# EAGLE design device (EAGLE 8.2.2)
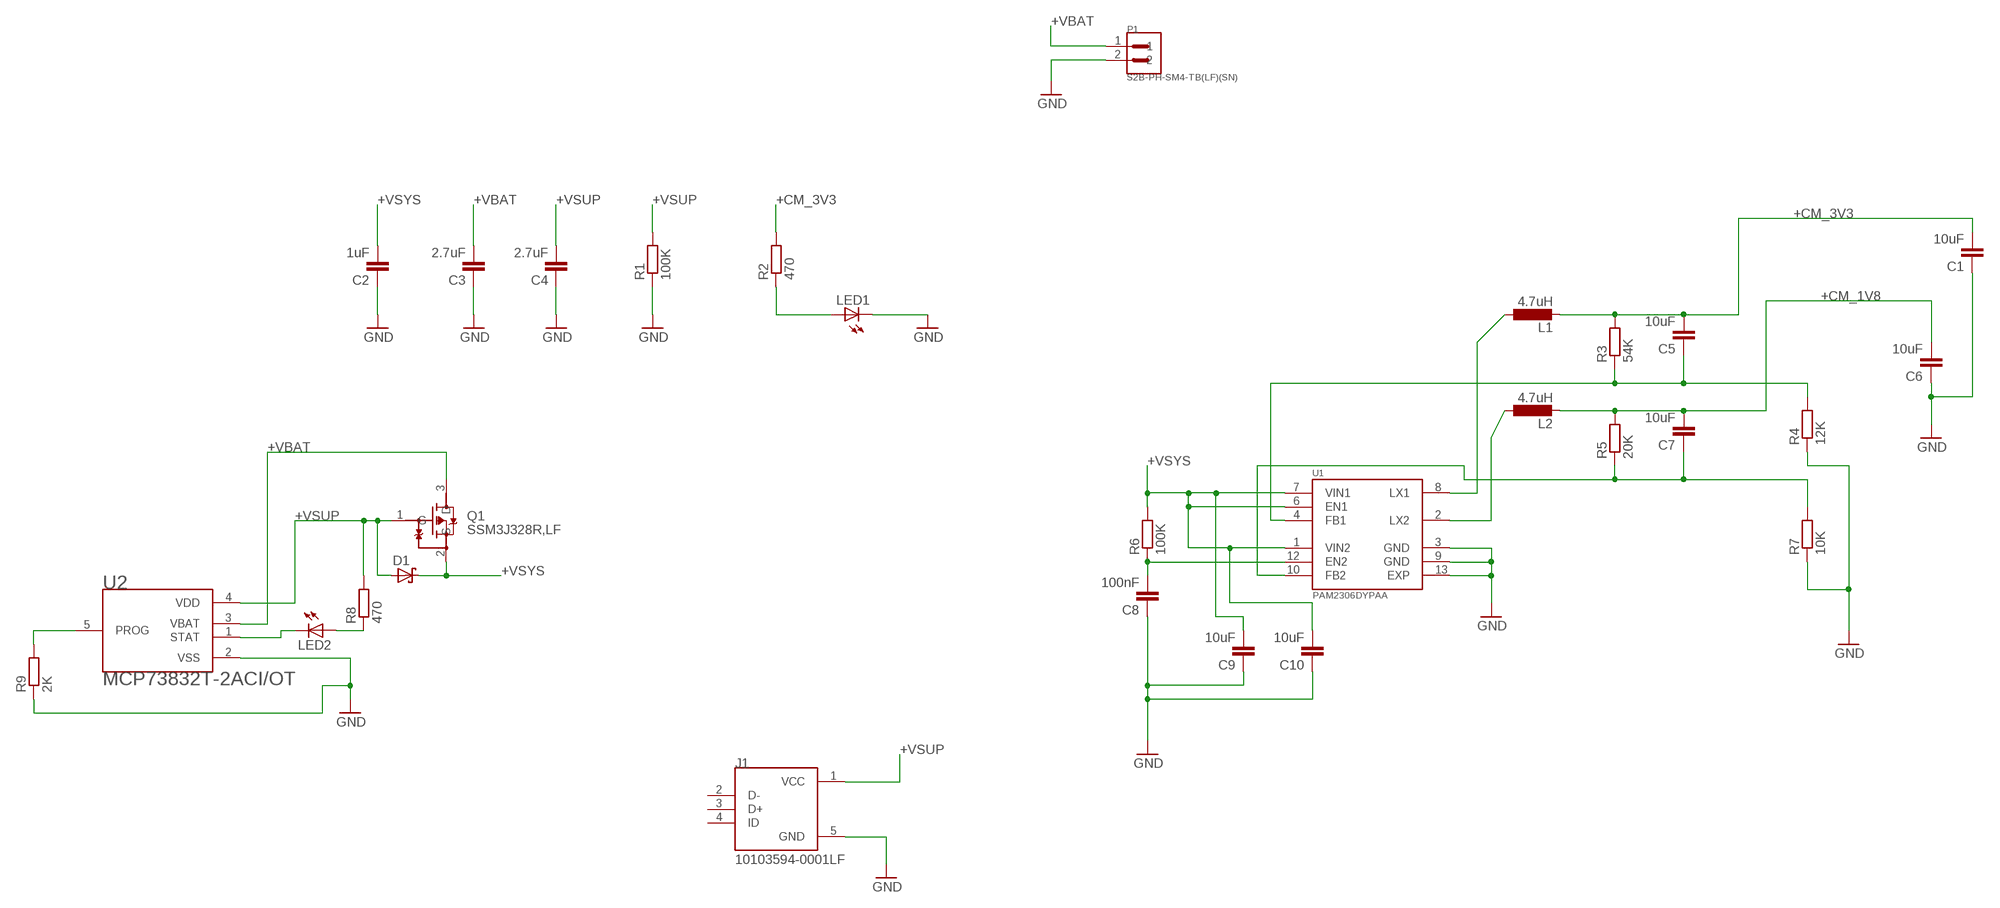
[diagram p0: schematic, sheet 1, part 1 of 2]
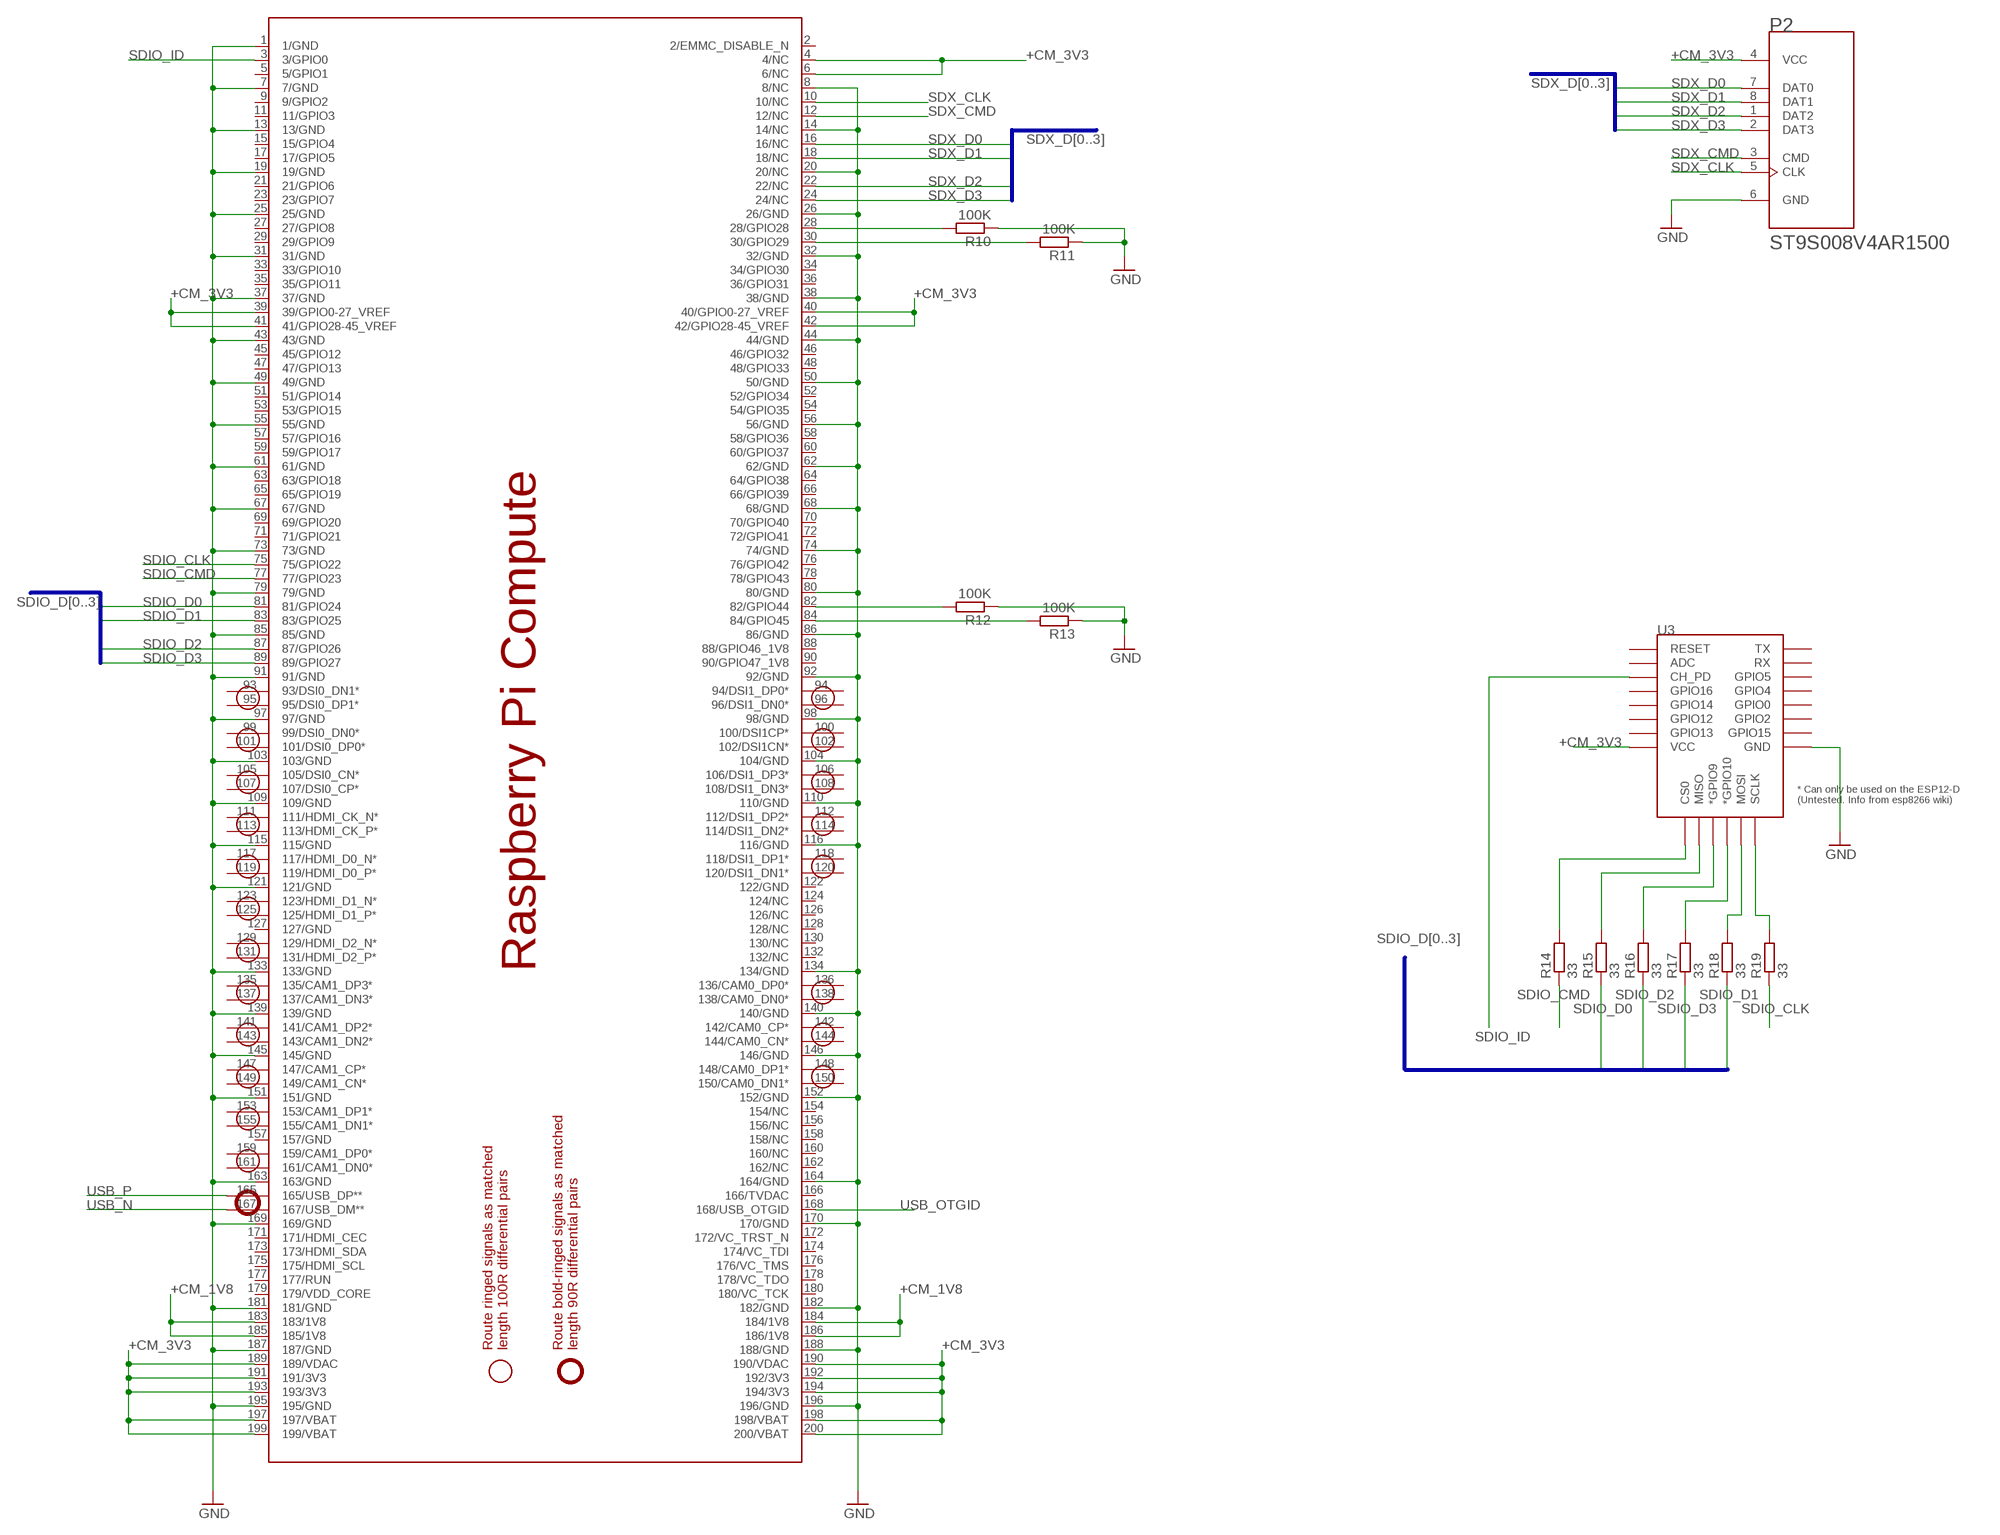
[diagram p1: schematic, sheet 1, part 2 of 2]

## Parts
C1  10uF  C-EUC0603  [C0603]
C2  1uF  C-EUC0603  [C0603]
C3  2.7uF  C-EUC0603  [C0603]
C4  2.7uF  C-EUC0603  [C0603]
C5  10uF  C-EUC0603  [C0603]
C6  10uF  C-EUC0603  [C0603]
C7  10uF  C-EUC0603  [C0603]
C8  100nF  C-EUC0603  [C0603]
C9  10uF  C-EUC0603  [C0603]
C10  10uF  C-EUC0603  [C0603]
D1  SCHOTTKY-DIODESMD  [SMB]
J1  10103594-0001LF  [FCI_10103594-0001LF]
L1  4.7uH  L-EUL1812  [L1812]
L2  4.7uH  L-EUL1812  [L1812]
LED1  LEDCHIP-LED0603  [CHIP-LED0603]
LED2  LEDCHIP-LED0603  [CHIP-LED0603]
P1  S2B-PH-SM4-TB(LF)(SN)  [JST_S2B-PH-SM4-TB(LF)(SN)]
P2  ST9S008V4AR1500  [JAE_ST9S008V4AR1500]
PCB1  RPI_COMPUTE  [RPI_COMPUTE]
Q1  SSM3J328R,LF  [SOT95P240X88-3N]
R1  100K  R-EU_R0603  [R0603]
R2  470  R-EU_R0603  [R0603]
R3  54K  R-EU_R0603  [R0603]
R4  12K  R-EU_R0603  [R0603]
R5  20K  R-EU_R0603  [R0603]
R6  100K  R-EU_R0603  [R0603]
R7  10K  R-EU_R0603  [R0603]
R8  470  R-EU_R0603  [R0603]
R9  2K  R-EU_R0603  [R0603]
R10  100K  R-EU_R0603  [R0603]
R11  100K  R-EU_R0603  [R0603]
R12  100K  R-EU_R0603  [R0603]
R13  100K  R-EU_R0603  [R0603]
R14  33  R-EU_R0603  [R0603]
R15  33  R-EU_R0603  [R0603]
R16  33  R-EU_R0603  [R0603]
R17  33  R-EU_R0603  [R0603]
R18  33  R-EU_R0603  [R0603]
R19  33  R-EU_R0603  [R0603]
U1  PAM2306DYPAA  [SON45P300X300X80-13N]
U2  MCP73832T-2ACI/OT  [SOT95P270X145-5N]
U3  ESP12ESMD  [ESP12E-SMD]

## Nets
+CM_1V8 [power]: C6.2 C7.2 L2.2 PCB1.183(183/1V8) PCB1.184(184/1V8) PCB1.185(185/1V8) PCB1.186(186/1V8) R5.2
+CM_3V3 [power]: C1.2 C5.2 L1.2 P2.4(VCC) PCB1.4(4/NC) PCB1.6(6/NC) PCB1.39(39/GPIO0-27_VREF) PCB1.40(40/GPIO0-27_VREF) PCB1.41(41/GPIO28-45_VREF) PCB1.42(42/GPIO28-45_VREF) PCB1.189(189/VDAC) PCB1.190(190/VDAC) PCB1.191(191/3V3) PCB1.192(192/3V3) PCB1.193(193/3V3) PCB1.194(194/3V3) PCB1.197(197/VBAT) PCB1.198(198/VBAT) PCB1.199(199/VBAT) PCB1.200(200/VBAT) R2.2 R3.2 U3.VCC
+VBAT [power]: C3.2 P1.1 Q1.3(D) U2.3(VBAT)
+VSUP [power]: C4.2 D1.A J1.1(VCC) Q1.1(G) R1.2 R8.2 U2.4(VDD)
+VSYS [power]: C2.2 C9.2 C10.2 D1.C Q1.2(S) R6.2 U1.1(VIN2) U1.6(EN1) U1.7(VIN1)
GND [power]: C1.1 C2.1 C3.1 C4.1 C6.1 C8.1 C9.1 C10.1 J1.5(GND) LED1.C P1.2 P2.6(GND) PCB1.1(1/GND) PCB1.7(7/GND) PCB1.8(8/NC) PCB1.13(13/GND) PCB1.14(14/NC) PCB1.19(19/GND) PCB1.20(20/NC) PCB1.25(25/GND) PCB1.26(26/GND) PCB1.31(31/GND) PCB1.32(32/GND) PCB1.37(37/GND) PCB1.38(38/GND) PCB1.43(43/GND) PCB1.44(44/GND) PCB1.49(49/GND) PCB1.50(50/GND) PCB1.55(55/GND) PCB1.56(56/GND) PCB1.61(61/GND) PCB1.62(62/GND) PCB1.67(67/GND) PCB1.68(68/GND) PCB1.73(73/GND) PCB1.74(74/GND) PCB1.79(79/GND) PCB1.80(80/GND) PCB1.85(85/GND) PCB1.86(86/GND) PCB1.91(91/GND) PCB1.92(92/GND) PCB1.97(97/GND) PCB1.98(98/GND) PCB1.103(103/GND) PCB1.104(104/GND) PCB1.109(109/GND) PCB1.110(110/GND) PCB1.115(115/GND) PCB1.116(116/GND) PCB1.121(121/GND) PCB1.133(133/GND) PCB1.134(134/GND) PCB1.139(139/GND) PCB1.140(140/GND) PCB1.145(145/GND) PCB1.146(146/GND) PCB1.151(151/GND) PCB1.152(152/GND) PCB1.163(163/GND) PCB1.164(164/GND) PCB1.169(169/GND) PCB1.170(170/GND) PCB1.181(181/GND) PCB1.182(182/GND) PCB1.187(187/GND) PCB1.188(188/GND) PCB1.195(195/GND) PCB1.196(196/GND) R1.1 R4.1 R7.1 R9.1 R10.1 R11.1 R12.1 R13.1 U1.3(GND) U1.9(GND) U1.13(EXP) U2.2(VSS) U3.GND
N$1: PCB1.84(84/GPIO45) R13.2
N$2: C8.2 R6.1 U1.12(EN2)
N$3: LED2.C U2.1(STAT)
N$4 [power]: R9.2 U2.5(PROG)
N$5: LED2.A R8.1
N$6: PCB1.28(28/GPIO28) R10.2
N$7: PCB1.30(30/GPIO29) R11.2
N$8: C5.1 R3.1 R4.2 U1.4(FB1)
N$9: PCB1.82(82/GPIO44) R12.2
N$10: C7.1 R5.1 R7.2 U1.10(FB2)
N$11 [power]: L1.1 U1.8(LX1)
N$12 [power]: L2.1 U1.2(LX2)
N$14: LED1.A R2.1
N$15: R19.2 U3.SCLK
N$16: R18.2 U3.MOSI
N$17: R17.2 U3.GPIO10(*GPIO10)
N$18: R16.2 U3.GPIO9(*GPIO9)
N$19: R15.2 U3.MISO
N$20: R14.2 U3.CS0
SDIO_CLK: PCB1.75(75/GPIO22) R19.1
SDIO_CMD: PCB1.77(77/GPIO23) R14.1
SDIO_D0: PCB1.81(81/GPIO24) R15.1
SDIO_D1: PCB1.83(83/GPIO25) R18.1
SDIO_D2: PCB1.87(87/GPIO26) R16.1
SDIO_D3: PCB1.89(89/GPIO27) R17.1
SDIO_ID: PCB1.3(3/GPIO0) U3.CH_PD
SDX_CLK: P2.5(CLK) PCB1.10(10/NC)
SDX_CMD: P2.3(CMD) PCB1.12(12/NC)
SDX_D0: P2.7(DAT0) PCB1.16(16/NC)
SDX_D1: P2.8(DAT1) PCB1.18(18/NC)
SDX_D2: P2.1(DAT2) PCB1.22(22/NC)
SDX_D3: P2.2(DAT3) PCB1.24(24/NC)
USB_N: PCB1.167(167/USB_DM**)
USB_OTGID: PCB1.168(168/USB_OTGID)
USB_P: PCB1.165(165/USB_DP**)
Unconnected: J1.2(D-) J1.3(D+) J1.4(ID) PCB1.2(2/EMMC_DISABLE_N) PCB1.5(5/GPIO1) PCB1.9(9/GPIO2) PCB1.11(11/GPIO3) PCB1.15(15/GPIO4) PCB1.17(17/GPIO5) PCB1.21(21/GPIO6) PCB1.23(23/GPIO7) PCB1.27(27/GPIO8) PCB1.29(29/GPIO9) PCB1.33(33/GPIO10) PCB1.34(34/GPIO30) PCB1.35(35/GPIO11) PCB1.36(36/GPIO31) PCB1.45(45/GPIO12) PCB1.46(46/GPIO32) PCB1.47(47/GPIO13) PCB1.48(48/GPIO33) PCB1.51(51/GPIO14) PCB1.52(52/GPIO34) PCB1.53(53/GPIO15) PCB1.54(54/GPIO35) PCB1.57(57/GPIO16) PCB1.58(58/GPIO36) PCB1.59(59/GPIO17) PCB1.60(60/GPIO37) PCB1.63(63/GPIO18) PCB1.64(64/GPIO38) PCB1.65(65/GPIO19) PCB1.66(66/GPIO39) PCB1.69(69/GPIO20) PCB1.70(70/GPIO40) PCB1.71(71/GPIO21) PCB1.72(72/GPIO41) PCB1.76(76/GPIO42) PCB1.78(78/GPIO43) PCB1.88(88/GPIO46_1V8) PCB1.90(90/GPIO47_1V8) PCB1.93(93/DSI0_DN1*) PCB1.94(94/DSI1_DP0*) PCB1.95(95/DSI0_DP1*) PCB1.96(96/DSI1_DN0*) PCB1.99(99/DSI0_DN0*) PCB1.100(100/DSI1CP*) PCB1.101(101/DSI0_DP0*) PCB1.102(102/DSI1CN*) PCB1.105(105/DSI0_CN*) PCB1.106(106/DSI1_DP3*) PCB1.107(107/DSI0_CP*) PCB1.108(108/DSI1_DN3*) PCB1.111(111/HDMI_CK_N*) PCB1.112(112/DSI1_DP2*) PCB1.113(113/HDMI_CK_P*) PCB1.114(114/DSI1_DN2*) PCB1.117(117/HDMI_D0_N*) PCB1.118(118/DSI1_DP1*) PCB1.119(119/HDMI_D0_P*) PCB1.120(120/DSI1_DN1*) PCB1.122(122/GND) PCB1.123(123/HDMI_D1_N*) PCB1.124(124/NC) PCB1.125(125/HDMI_D1_P*) PCB1.126(126/NC) PCB1.127(127/GND) PCB1.128(128/NC) PCB1.129(129/HDMI_D2_N*) PCB1.130(130/NC) PCB1.131(131/HDMI_D2_P*) PCB1.132(132/NC) PCB1.135(135/CAM1_DP3*) PCB1.136(136/CAM0_DP0*) PCB1.137(137/CAM1_DN3*) PCB1.138(138/CAM0_DN0*) PCB1.141(141/CAM1_DP2*) PCB1.142(142/CAM0_CP*) PCB1.143(143/CAM1_DN2*) PCB1.144(144/CAM0_CN*) PCB1.147(147/CAM1_CP*) PCB1.148(148/CAM0_DP1*) PCB1.149(149/CAM1_CN*) PCB1.150(150/CAM0_DN1*) PCB1.153(153/CAM1_DP1*) PCB1.154(154/NC) PCB1.155(155/CAM1_DN1*) PCB1.156(156/NC) PCB1.157(157/GND) PCB1.158(158/NC) PCB1.159(159/CAM1_DP0*) PCB1.160(160/NC) PCB1.161(161/CAM1_DN0*) PCB1.162(162/NC) PCB1.166(166/TVDAC) PCB1.171(171/HDMI_CEC) PCB1.172(172/VC_TRST_N) PCB1.173(173/HDMI_SDA) PCB1.174(174/VC_TDI) PCB1.175(175/HDMI_SCL) PCB1.176(176/VC_TMS) PCB1.177(177/RUN) PCB1.178(178/VC_TDO) PCB1.179(179/VDD_CORE) PCB1.180(180/VC_TCK) U3.ADC U3.GPIO0 U3.GPIO2 U3.GPIO4 U3.GPIO5 U3.GPIO12 U3.GPIO13 U3.GPIO14 U3.GPIO15 U3.GPIO16 U3.RESET U3.RXD0(RX) U3.TXD0(TX)

## Buses
SDX_D[0..3]
SDIO_D[0..3]

## Library data of the parts
C1-C10 = resistor:C-EU: CAPACITOR, European symbol
D1 = diode:SCHOTTKY-DIODE: Schottky Diode
J1 = Common-Parts-Library-Eagle:10103594-0001LF: Conn Micro USB Type B RCP 5 POS 0.65mm Solder RA SMD 5 Terminal 1 Port T/R; MANUFACTURER: Framatome
L1 L2 = resistor:L-EU: INDUCTOR, European symbol
LED1 LED2 = led:LED: LED OSRAM: - CHIPLED LG R971, LG N971, LY N971, LG Q971, LY Q971, LO R971, LY R971 LH N974, LH R974 LS Q976, LO Q976, LY Q976 LO Q996 - Hyper CHIPLED LW Q18S LB Q993, LB Q99A, LB R99A - SideLED LS A670, LO A670, LY A670, LG A670, LP A670 LB A673, LV A673, LT A673, LW A673 LH A674 LY A675 LS A676, LA A676, LO A676, LY A676, LW A676 LS A679, LY A679, LG A679 - Hyper Micro SIDELED® LS Y876, LA Y876, LO Y876, LY Y876 LT Y87S - SmartLED LW L88C, LW L88S LB L89C, LB L89S, LG L890 LS L89K, LO L89K, LY L89K LS L896, LA L896, LO L896, LY L896 - TOPLED LS T670, LO T670, LY T670, LG T670, LP T670 LSG T670, LSP T670, LSY T670, LOP T670, LYG T670 LG T671, LOG T671, LSG T671 LB T673, LV T673, LT T673, LW T673 LH T674 LS T676, LA T676, LO T676, LY T676, LB T676, LH T676, LSB T676, LW T676 LB T67C, LV T67C, LT T67C, LS T67K, LO T67K, LY T67K, LW E67C LS E67B, LA E67B, LO E67B, LY E67B, LB E67C, LV E67C, LT E67C LW T67C LS T679, LY T679, LG T679 LS T770, LO T770, LY T770, LG T770, LP T770 LB T773, LV T773, LT T773, LW T773 LH T774 LS E675, LA E675, LY E675, LS T675 LS T776, LA T776, LO T776, LY T776, LB T776 LHGB T686 LT T68C, LB T68C - Hyper Mini TOPLED® LB M676 - Mini TOPLED Santana® LG M470 LS M47K, LO M47K, LY M47K Source: http://www.osram.convergy.de LUXEON: - LUMILED® LXK2-PW12-R00, LXK2-PW12-S00, LXK2-PW14-U00, LXK2-PW14-V00 LXK2-PM12-R00, LXK2-PM12-S00, LXK2-PM14-U00 LXK2-PE12-Q00, LXK2-PE12-R00, LXK2-PE12-S00, LXK2-PE14-T00, LXK2-PE14-U00 LXK2-PB12-K00, LXK2-PB12-L00, LXK2-PB12-M00, LXK2-PB14-N00, LXK2-PB14-P00, LXK2-PB14-Q00 LXK2-PR12-L00, LXK2-PR12-M00, LXK2-PR14-Q00, LXK2-PR14-R00 LXK2-PD12-Q00, LXK2-PD12-R00, LXK2-PD12-S00 LXK2-PH12-R00, LXK2-PH12-S00 LXK2-PL12-P00, LXK2-PL12-Q00, LXK2-PL12-R00 Source: www.luxeon.com KINGBRIGHT: KA-3528ASYC Source: www.kingbright.com
P1 = Common-Parts-Library-Eagle:S2B-PH-SM4-TB(LF)(SN): CONN HEADER PH SIDE 2POS 2MM SMD; MANUFACTURER: JST
P2 = Common-Parts-Library-Eagle:ST9S008V4AR1500: Conn; Data; microSD; 8+2Cnts; SMD/SMT; SF9Series; RtAngle; 0.5A; 10V; forMicroSDCard; MANUFACTURER: JAE
PCB1 = e14_Rpi_Compute_RevC:RPI_COMPUTE: Device for a Raspberry PI Compute module. Note that the package is for a DDR2 connector of 'standard' orientation. Example: TE Connectivity P/N: 1565917-4, Newark P/N: 08P0616, Farnell P/N: 2112525 More information is available at http://www.element14.com/community/community/raspberry-pi/raspberry-pi-compute-module
Q1 = Common-Parts-Library-Eagle:SSM3J328R,LF: Trans MOSFET P-CH 20V 6A 3-Pin SOT-23F; MANUFACTURER: Toshiba
R1-R19 = resistor:R-EU_: RESISTOR, European symbol
U1 = PAM2306DYPAA:PAM2306DYPAA: PAM2306 Series 5.5V 1A Dual High Efficiency PWM Step Down DC-DC Converter-WDFN12; AVAILABILITY: Good; DESCRIPTION: PAM2306 Series 5.5V 1A Dual High Efficiency PWM Step Down DC-DC Converter-WDFN12; MF: Diodes Inc.; MP: PAM2306DYPAA; PACKAGE: WFDFN-12 Diodes Inc.; PRICE: 0.41 USD
U2 = Common-Parts-Library-Eagle:MCP73832T-2ACI/OT: MCP73832 Series Single-Cell Li-Ion/Li-Polymer Battery Charge Controller SOT-23-5; MANUFACTURER: Microchip
U3 = esp8266modules:ESP12E: ESP12E Module

## Net classes
0 default: width 0.203 mm
1 power: width 0.305 mm, drill 0.406 mm

## Board
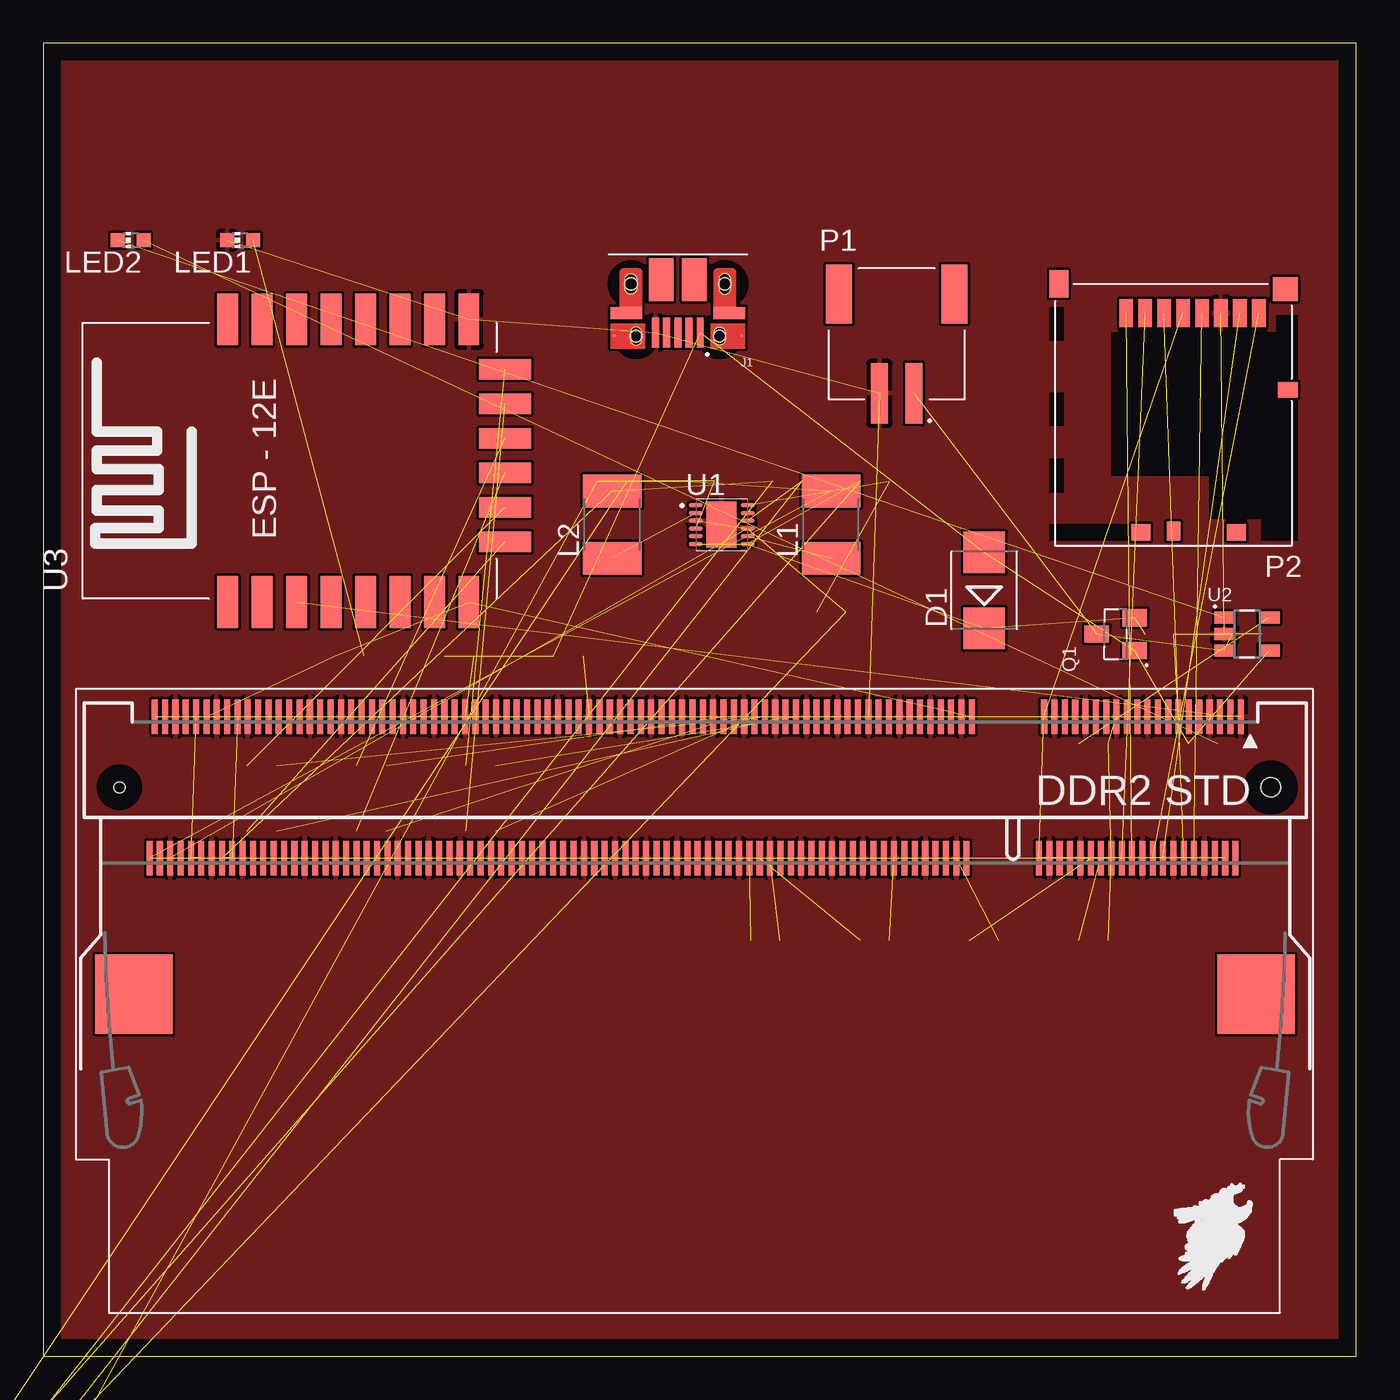
[diagram p2: board, top side]
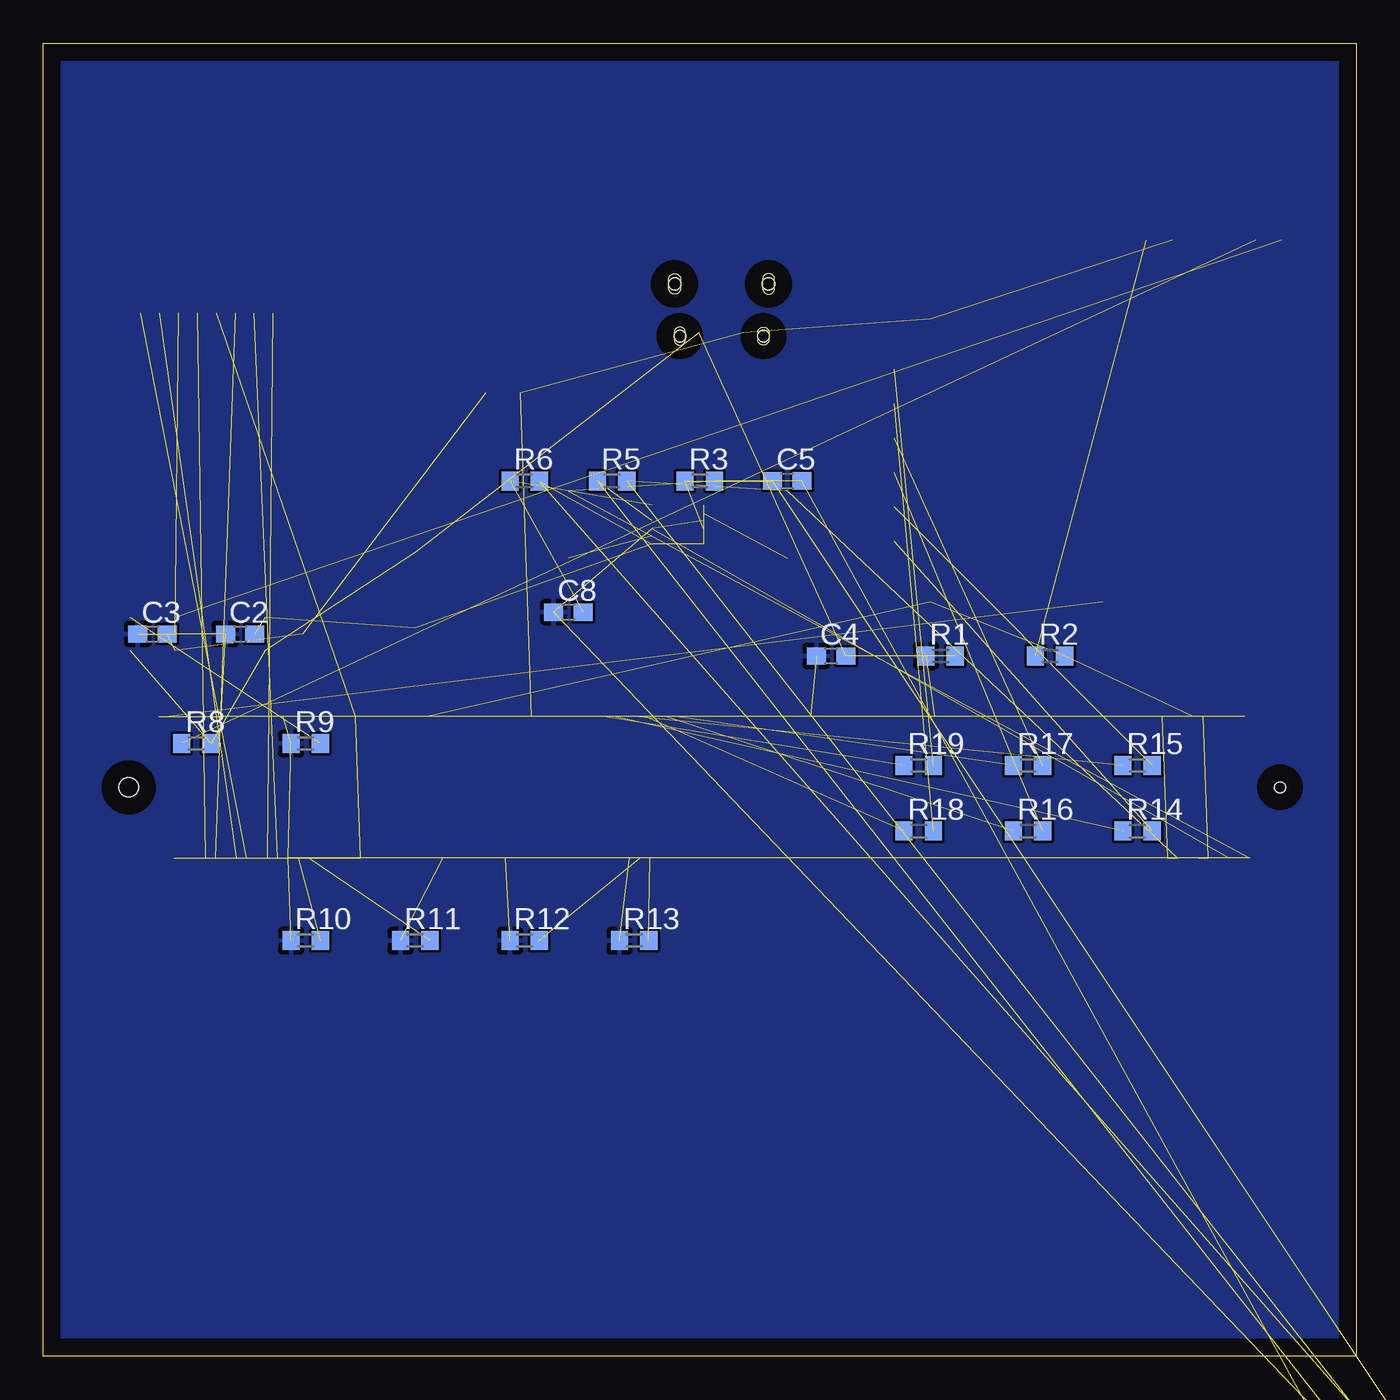
[diagram p3: board, bottom side, seen from below]

Size 76.2 x 76.2 mm. Coordinates in mm from the lower left corner, seen from the top.
Outline: 0,0 76.2,0 76.2,76.2 0,76.2 0,0
Copper layers (1*16): Top 0.035mm / dielectric 1.5mm / Bottom 0.035mm
Design rules "default": minimum track width 6mil, minimum drill 0.35mm, track to track 6mil, track to pad 6mil, pad to pad 6mil, via to via 6mil, smd to smd 6mil, copper to edge 40mil, drill to drill 6mil, minimum pad ring 10mil, minimum via ring 8mil, stop-mask expansion 4mil, vias tented up to drill 0mil, thermal gap 10mil

### Footprints (pad centres in the part's own frame; a part is rotated, then mirrored left to right if it is on the bottom)
C0603 = smd 1.1 x 1: 1 -0.85,0; 2 0.85,0
SMB = smd 2.4 x 2.4: A 2.2,0; C -2.2,0
FCI_10103594-0001LF = smd 0.4 x 1.75: 1 -1.3,2.825; 2 -0.65,2.825; 3 0,2.825; 4 0.65,2.825; 5 1.3,2.825 | smd 0.1 x 0.1: P1 -3.7,3; P2 3.7,3 | smd 1.825 x 0.7: P3 -2.987,1.7; P4 2.987,1.7 | smd 1.425 x 2.5: P5 -0.963,-0.25; P6 0.963,-0.25 | hole 0.7: -2.725,0; 2.725,0 | hole 0.65: -2.425,3.03; 2.425,3.03
L1812 = smd 1.9 x 3.4: 1 -1.95,0; 2 1.95,0
CHIP-LED0603 = smd 0.8 x 0.8: A 0,-0.75; C 0,0.75
JST_S2B-PH-SM4-TB(LF)(SN) = smd 1 x 3.5: 1 1,0; 2 -1,0 | smd 1.5 x 3.4: P1 3.35,5.75; P2 -3.35,5.75
JAE_ST9S008V4AR1500 = smd 0.8 x 1.6: 1 3.2,1.7; 2 2.1,1.7; 3 1,1.7; 4 -0.1,1.7; 5 -1.2,1.7; 6 -2.3,1.7; 7 -3.4,1.7; 8 -4.5,1.7 | smd 1.1 x 0.95: PAD1 -3.2,14.425; PAD3 2.35,14.425 | smd 0.8 x 1.1: PAD2 0.45,14.35 | smd 1.15 x 0.9: PAD4 -6.175,6.15 | smd 1.45 x 1.4: PAD5 -6.025,0.3 | smd 1.1 x 1.6: PAD6 7.1,0
RPI_COMPUTE = smd 0.35 x 2: 1 -31.38,-4.1; 2 -31.08,4.1; 3 -30.78,-4.1; 4 -30.48,4.1; 5 -30.18,-4.1; 6 -29.88,4.1; 7 -29.58,-4.1; 8 -29.28,4.1; 9 -28.98,-4.1; 10 -28.68,4.1; 11 -28.38,-4.1; 12 -28.08,4.1; 13 -27.78,-4.1; 14 -27.48,4.1; 15 -27.18,-4.1; 16 -26.88,4.1; 17 -26.58,-4.1; 18 -26.28,4.1; 19 -25.98,-4.1; 20 -25.68,4.1; 21 -25.38,-4.1; 22 -25.08,4.1; 23 -24.78,-4.1; 24 -24.48,4.1; 25 -24.18,-4.1; 26 -23.88,4.1; 27 -23.58,-4.1; 28 -23.28,4.1; 29 -22.98,-4.1; 30 -22.68,4.1; 31 -22.38,-4.1; 32 -22.08,4.1; 33 -21.78,-4.1; 34 -21.48,4.1; 35 -21.18,-4.1; 36 -20.88,4.1; 37 -20.58,-4.1; 38 -20.28,4.1; 39 -19.98,-4.1; 40 -19.68,4.1; 41 -15.78,-4.1; 42 -15.48,4.1; 43 -15.18,-4.1; 44 -14.88,4.1; 45 -14.58,-4.1; 46 -14.28,4.1; 47 -13.98,-4.1; 48 -13.68,4.1; 49 -13.38,-4.1; 50 -13.08,4.1; 51 -12.78,-4.1; 52 -12.48,4.1; 53 -12.18,-4.1; 54 -11.88,4.1; 55 -11.58,-4.1; 56 -11.28,4.1; 57 -10.98,-4.1; 58 -10.68,4.1; 59 -10.38,-4.1; 60 -10.08,4.1; 61 -9.78,-4.1; 62 -9.48,4.1; 63 -9.18,-4.1; 64 -8.88,4.1; 65 -8.58,-4.1; 66 -8.28,4.1; 67 -7.98,-4.1; 68 -7.68,4.1; 69 -7.38,-4.1; 70 -7.08,4.1; 71 -6.78,-4.1; 72 -6.48,4.1; 73 -6.18,-4.1; 74 -5.88,4.1; 75 -5.58,-4.1; 76 -5.28,4.1; 77 -4.98,-4.1; 78 -4.68,4.1; 79 -4.38,-4.1; 80 -4.08,4.1; 81 -3.78,-4.1; 82 -3.48,4.1; 83 -3.18,-4.1; 84 -2.88,4.1; 85 -2.58,-4.1; 86 -2.28,4.1; 87 -1.98,-4.1; 88 -1.68,4.1; 89 -1.38,-4.1; 90 -1.08,4.1; 91 -0.78,-4.1; 92 -0.48,4.1; 93 -0.18,-4.1; 94 0.12,4.1; 95 0.42,-4.1; 96 0.72,4.1; 97 1.02,-4.1; 98 1.32,4.1; 99 1.62,-4.1; 100 1.92,4.1; 101 2.22,-4.1; 102 2.52,4.1; 103 2.82,-4.1; 104 3.12,4.1; 105 3.42,-4.1; 106 3.72,4.1; 107 4.02,-4.1; 108 4.32,4.1; 109 4.62,-4.1; 110 4.92,4.1; 111 5.22,-4.1; 112 5.52,4.1; 113 5.82,-4.1; 114 6.12,4.1; 115 6.42,-4.1; 116 6.72,4.1; 117 7.02,-4.1; 118 7.32,4.1; 119 7.62,-4.1; 120 7.92,4.1; 121 8.22,-4.1; 122 8.52,4.1; 123 8.82,-4.1; 124 9.12,4.1; 125 9.42,-4.1; 126 9.72,4.1; 127 10.02,-4.1; 128 10.32,4.1; 129 10.62,-4.1; 130 10.92,4.1; 131 11.22,-4.1; 132 11.52,4.1; 133 11.82,-4.1; 134 12.12,4.1; 135 12.42,-4.1; 136 12.72,4.1; 137 13.02,-4.1; 138 13.32,4.1; 139 13.62,-4.1; 140 13.92,4.1; 141 14.22,-4.1; 142 14.52,4.1; 143 14.82,-4.1; 144 15.12,4.1; 145 15.42,-4.1; 146 15.72,4.1; 147 16.02,-4.1; 148 16.32,4.1; 149 16.62,-4.1; 150 16.92,4.1; 151 17.22,-4.1; 152 17.52,4.1; 153 17.82,-4.1; 154 18.12,4.1; 155 18.42,-4.1; 156 18.72,4.1; 157 19.02,-4.1; 158 19.32,4.1; 159 19.62,-4.1; 160 19.92,4.1; 161 20.22,-4.1; 162 20.52,4.1; 163 20.82,-4.1; 164 21.12,4.1; 165 21.42,-4.1; 166 21.72,4.1; 167 22.02,-4.1; 168 22.32,4.1; 169 22.62,-4.1; 170 22.92,4.1; 171 23.22,-4.1; 172 23.52,4.1; 173 23.82,-4.1; 174 24.12,4.1; 175 24.42,-4.1; 176 24.72,4.1; 177 25.02,-4.1; 178 25.32,4.1; 179 25.62,-4.1; 180 25.92,4.1; 181 26.22,-4.1; 182 26.52,4.1; 183 26.82,-4.1; 184 27.12,4.1; 185 27.42,-4.1; 186 27.72,4.1; 187 28.02,-4.1; 188 28.32,4.1; 189 28.62,-4.1; 190 28.92,4.1; 191 29.22,-4.1; 192 29.52,4.1; 193 29.82,-4.1; 194 30.12,4.1; 195 30.42,-4.1; 196 30.72,4.1; 197 31.02,-4.1; 198 31.32,4.1; 199 31.62,-4.1; 200 31.92,4.1 | smd 4.5 x 4.6: M1 -32.28,12; M2 32.82,12 | hole 1.1: -33.13,0 | hole 0.6: 33.67,0
SOT95P240X88-3N = smd 1 x 1.4: 1 -0.95,-1.1; 2 0.95,-1.1; 3 0,1.1
R0603 = smd 1 x 1.1: 1 -0.85,0; 2 0.85,0
SON45P300X300X80-13N = smd 0.8 x 0.25: 1 -1.5,1.125; 2 -1.5,0.675; 3 -1.5,0.225; 4 -1.5,-0.225; 5 -1.5,-0.675; 6 -1.5,-1.125; 7 1.5,-1.125; 8 1.5,-0.675; 9 1.5,-0.225; 10 1.5,0.225; 11 1.5,0.675; 12 1.5,1.125 | smd 1.75 x 2.65: 13 0,0
SOT95P270X145-5N = smd 1.2 x 0.7: 1 -1.3,0.95; 2 -1.3,0; 3 -1.3,-0.95; 4 1.3,-0.95; 5 1.3,0.95
ESP12E-SMD = smd 3 x 1.2: ADC -8.3,3.8; CH_PD -8.3,1.8; GND 8.1,-8.2; GPIO0 8.1,-2.2; GPIO2 8.1,-4.2; GPIO4 8.1,-0.2; GPIO5 8.1,1.8; GPIO12 -8.3,-4.2; GPIO13 -8.3,-6.2; GPIO14 -8.3,-2.2; GPIO15 8.1,-6.2; GPIO16 -8.3,-0.2; RESET -8.3,5.8; RXD0 8.1,3.8; TXD0 8.1,5.8; VCC -8.3,-8.2 | smd 1.2 x 3: CS0 -4.8,-10.3; GPIO9 -0.8,-10.3; GPIO10 1.2,-10.3; MISO -2.8,-10.3; MOSI 3.2,-10.3; SCLK 5.2,-10.3

### Placement (x,y rotation side)
C1  -26.67,-58.42 0 bottom  (outside the outline)
C2  64.77,41.91 0 bottom
C3  69.85,41.91 0 bottom
C4  30.48,40.64 0 bottom
C5  33.02,50.8 0 bottom
C6  -26.67,-53.34 0 bottom  (outside the outline)
C7  -26.67,-38.1 0 bottom  (outside the outline)
C8  45.72,43.18 0 bottom
C9  -7.62,-12.7 0 bottom  (outside the outline)
C10  -8.89,-17.78 0 bottom  (outside the outline)
D1  54.61,44.45 90 top
J1  36.83,62.23 180 top
L1  45.72,48.26 90 top
L2  33.02,48.26 90 top
LED1  11.43,64.77 90 top
LED2  5.08,64.77 90 top
P1  49.53,55.88 0 top
P2  66.04,62.23 180 top
PCB1  38.1,33.02 180 top
Q1  62.23,41.91 90 top
R1  24.13,40.64 0 bottom
R2  17.78,40.64 0 bottom
R3  38.1,50.8 0 bottom
R4  -27.94,-43.18 0 bottom  (outside the outline)
R5  43.18,50.8 0 bottom
R6  48.26,50.8 0 bottom
R7  -27.94,-48.26 0 bottom  (outside the outline)
R8  67.31,35.56 0 bottom
R9  60.96,35.56 0 bottom
R10  60.96,24.13 0 bottom
R11  54.61,24.13 0 bottom
R12  48.26,24.13 0 bottom
R13  41.91,24.13 0 bottom
R14  12.7,30.48 0 bottom
R15  12.7,34.29 0 bottom
R16  19.05,30.48 0 bottom
R17  19.05,34.29 0 bottom
R18  25.4,30.48 0 bottom
R19  25.4,34.29 0 bottom
U1  39.37,48.26 0 top
U2  69.85,41.91 0 top
U3  16.51,52.07 90 top

### Tracks (layer width: path | path; a pad name or v marks a point on that pad's centre or on a via)
+CM_1V8  (7 unrouted)
+CM_3V3  (22 unrouted)
+VBAT  (3 unrouted)
+VSUP  (6 unrouted)
+VSYS  (8 unrouted)
GND  (82 unrouted)
  pour Top: 0,76.2 0,0 76.2,0 76.2,76.2
  pour Bottom: 0,76.2 0,0 76.2,0 76.2,76.2
N$1  (1 unrouted)
N$2  (2 unrouted)
N$3  (1 unrouted)
N$4  (1 unrouted)
N$5  (1 unrouted)
N$6  (1 unrouted)
N$7  (1 unrouted)
N$8  (3 unrouted)
N$9  (1 unrouted)
N$10  (3 unrouted)
N$11  (1 unrouted)
N$12  (1 unrouted)
N$14  (1 unrouted)
N$15  (1 unrouted)
N$16  (1 unrouted)
N$17  (1 unrouted)
N$18  (1 unrouted)
N$19  (1 unrouted)
N$20  (1 unrouted)
SDIO_CLK  (1 unrouted)
SDIO_CMD  (1 unrouted)
SDIO_D0  (1 unrouted)
SDIO_D1  (1 unrouted)
SDIO_D2  (1 unrouted)
SDIO_D3  (1 unrouted)
SDIO_ID  (1 unrouted)
SDX_CLK  (1 unrouted)
SDX_CMD  (1 unrouted)
SDX_D0  (1 unrouted)
SDX_D1  (1 unrouted)
SDX_D2  (1 unrouted)
SDX_D3  (1 unrouted)